# EAGLE design Bordnetzwandler (EAGLE 6.6.0)

## Sheet 1 of 4: Supply
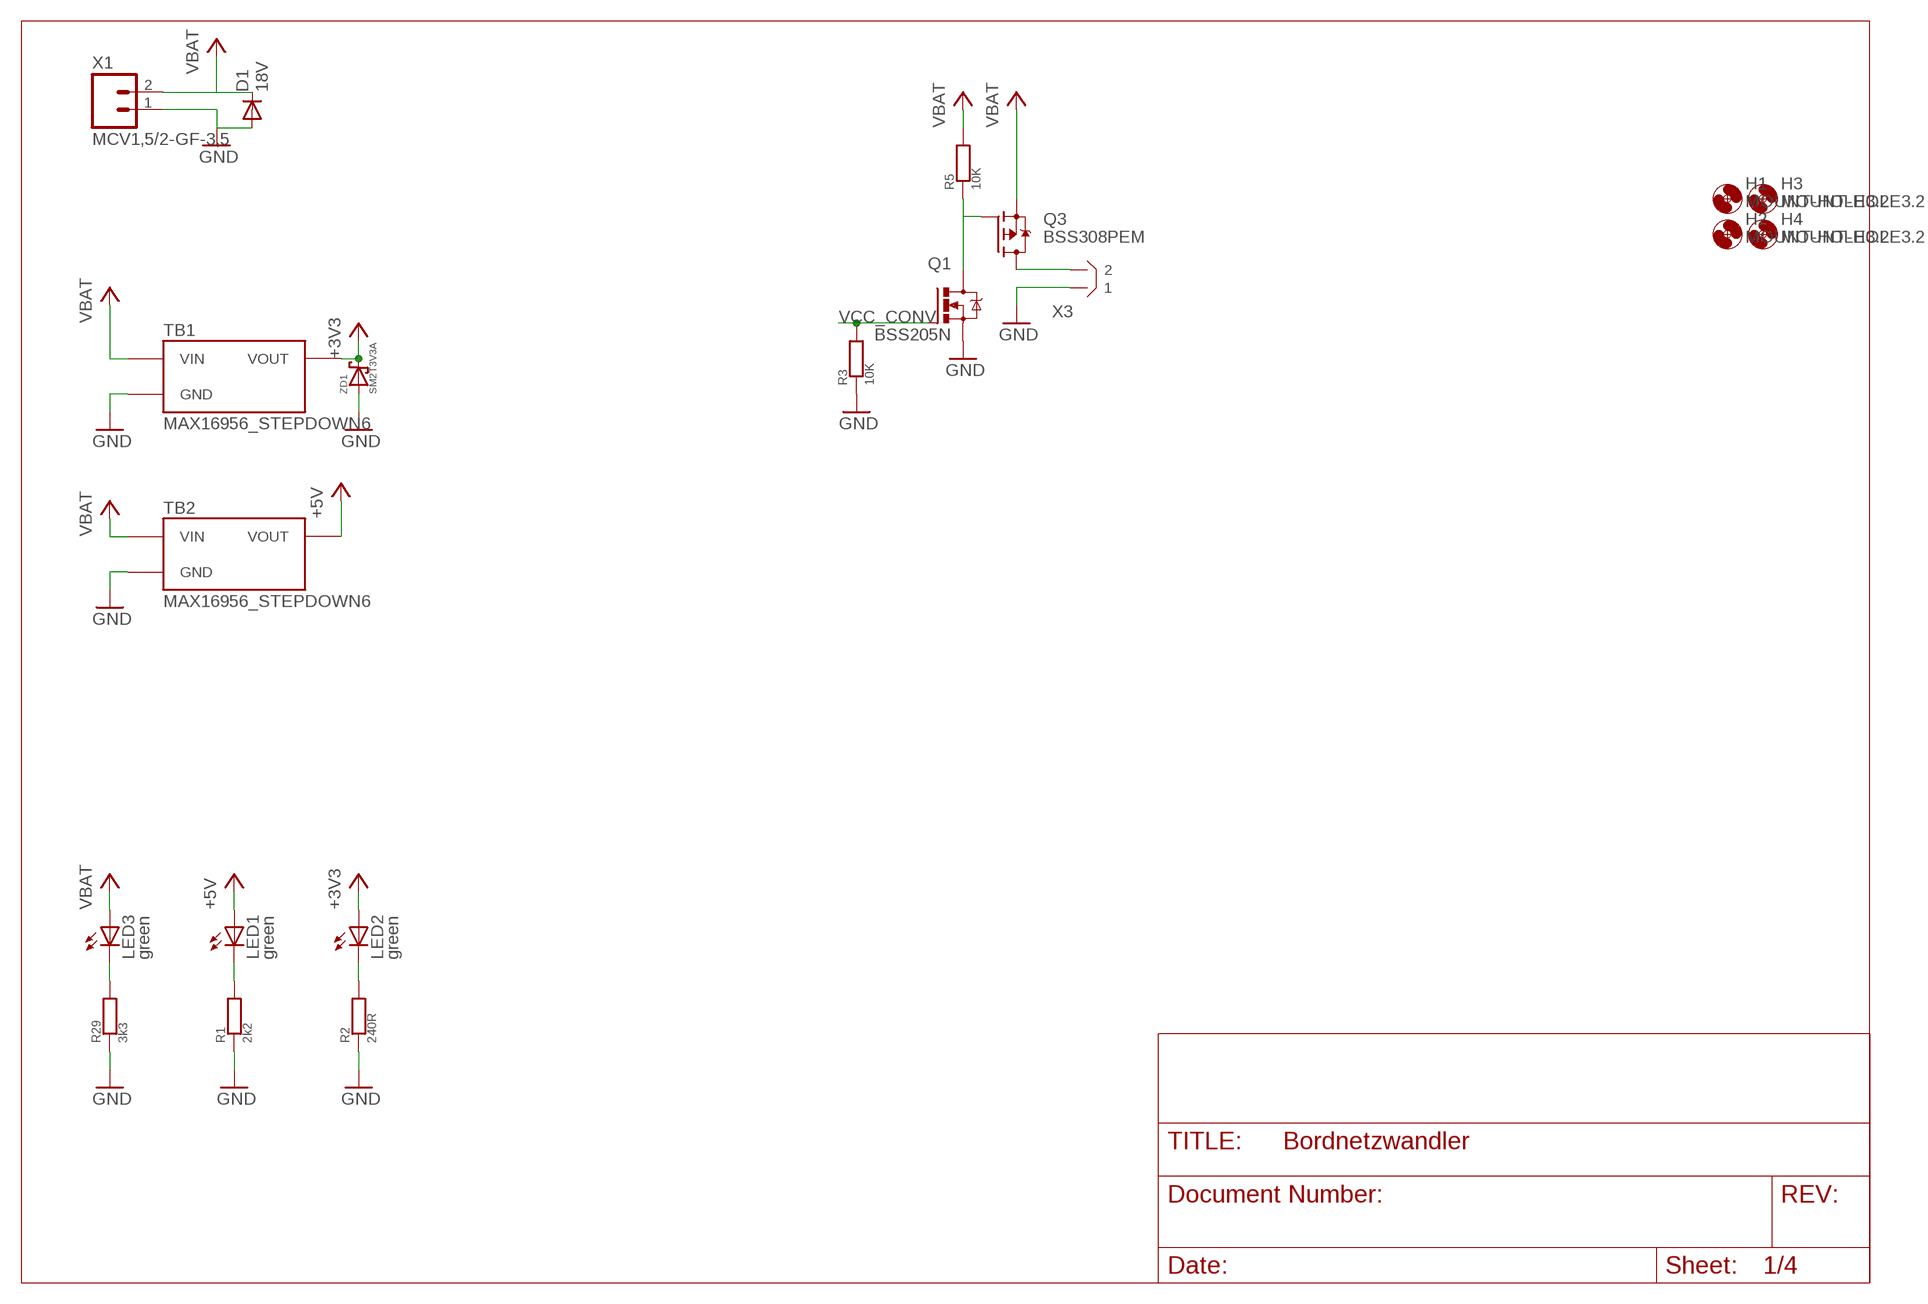
[diagram p0: schematic, sheet 1]

### Parts
D1  18V  DIODE-DO214AA  [DO214AA]
H1  MOUNT-HOLE3.2  [3,2]
H2  MOUNT-HOLE3.2  [3,2]
H3  MOUNT-HOLE3.2  [3,2]
H4  MOUNT-HOLE3.2  [3,2]
LED1  green  LEDCHIP-LED0805  [CHIP-LED0805]
LED2  green  LEDCHIP-LED0805  [CHIP-LED0805]
LED3  green  LEDCHIP-LED0805  [CHIP-LED0805]
Q1  BSS205N  [SOT23]
Q3  BSS308PEM  [INF-PG-SOT23_M_1PRIMARY]
R1  2k2  R  [R0805]
R2  240R  R  [R0805]
R3  10K  R  [R0805]
R5  10K  R  [R0805]
R29  3k3  R  [R0805]
TB1  MAX16956_STEPDOWN6  [MAX16956_STEPDOWN6]
TB2  MAX16956_STEPDOWN6  [MAX16956_STEPDOWN6]
X1  MCV1,5/2-GF-3,5  [MCV1,5/2-GF-3,5]
X3  B2B-XH  [B2B-XH]
ZD1  SM2T3V3A  [SM2T3V3A]

### Nets
+3V3: LED2.A TB1.VOUT ZD1.P$2 ; also sheet 2,4
+5V: LED1.A TB2.VOUT ; also sheet 2,3
GND: D1.A Q1.2(S) R1.1 R2.1 R3.1 R29.1 TB1.GND TB1.GND2(GND) TB2.GND TB2.GND2(GND) X1.1 X3.P$1 ZD1.P$1 ZD1.P$11 ; also sheet 2,3,4
N$1: LED1.C R1.2
N$2: LED2.C R2.2
N$3: Q1.3(D) Q3.1(G) R5.1
N$5: LED3.C R29.2
N$6: Q3.3(D) X3.P$2
VBAT: D1.C LED3.A Q3.2(S) R5.2 TB1.VIN TB2.VIN X1.2 ; also sheet 2,3,4
VCC_CONV: Q1.1(G) R3.2 ; also sheet 2

## Sheet 2 of 4: Prozessor
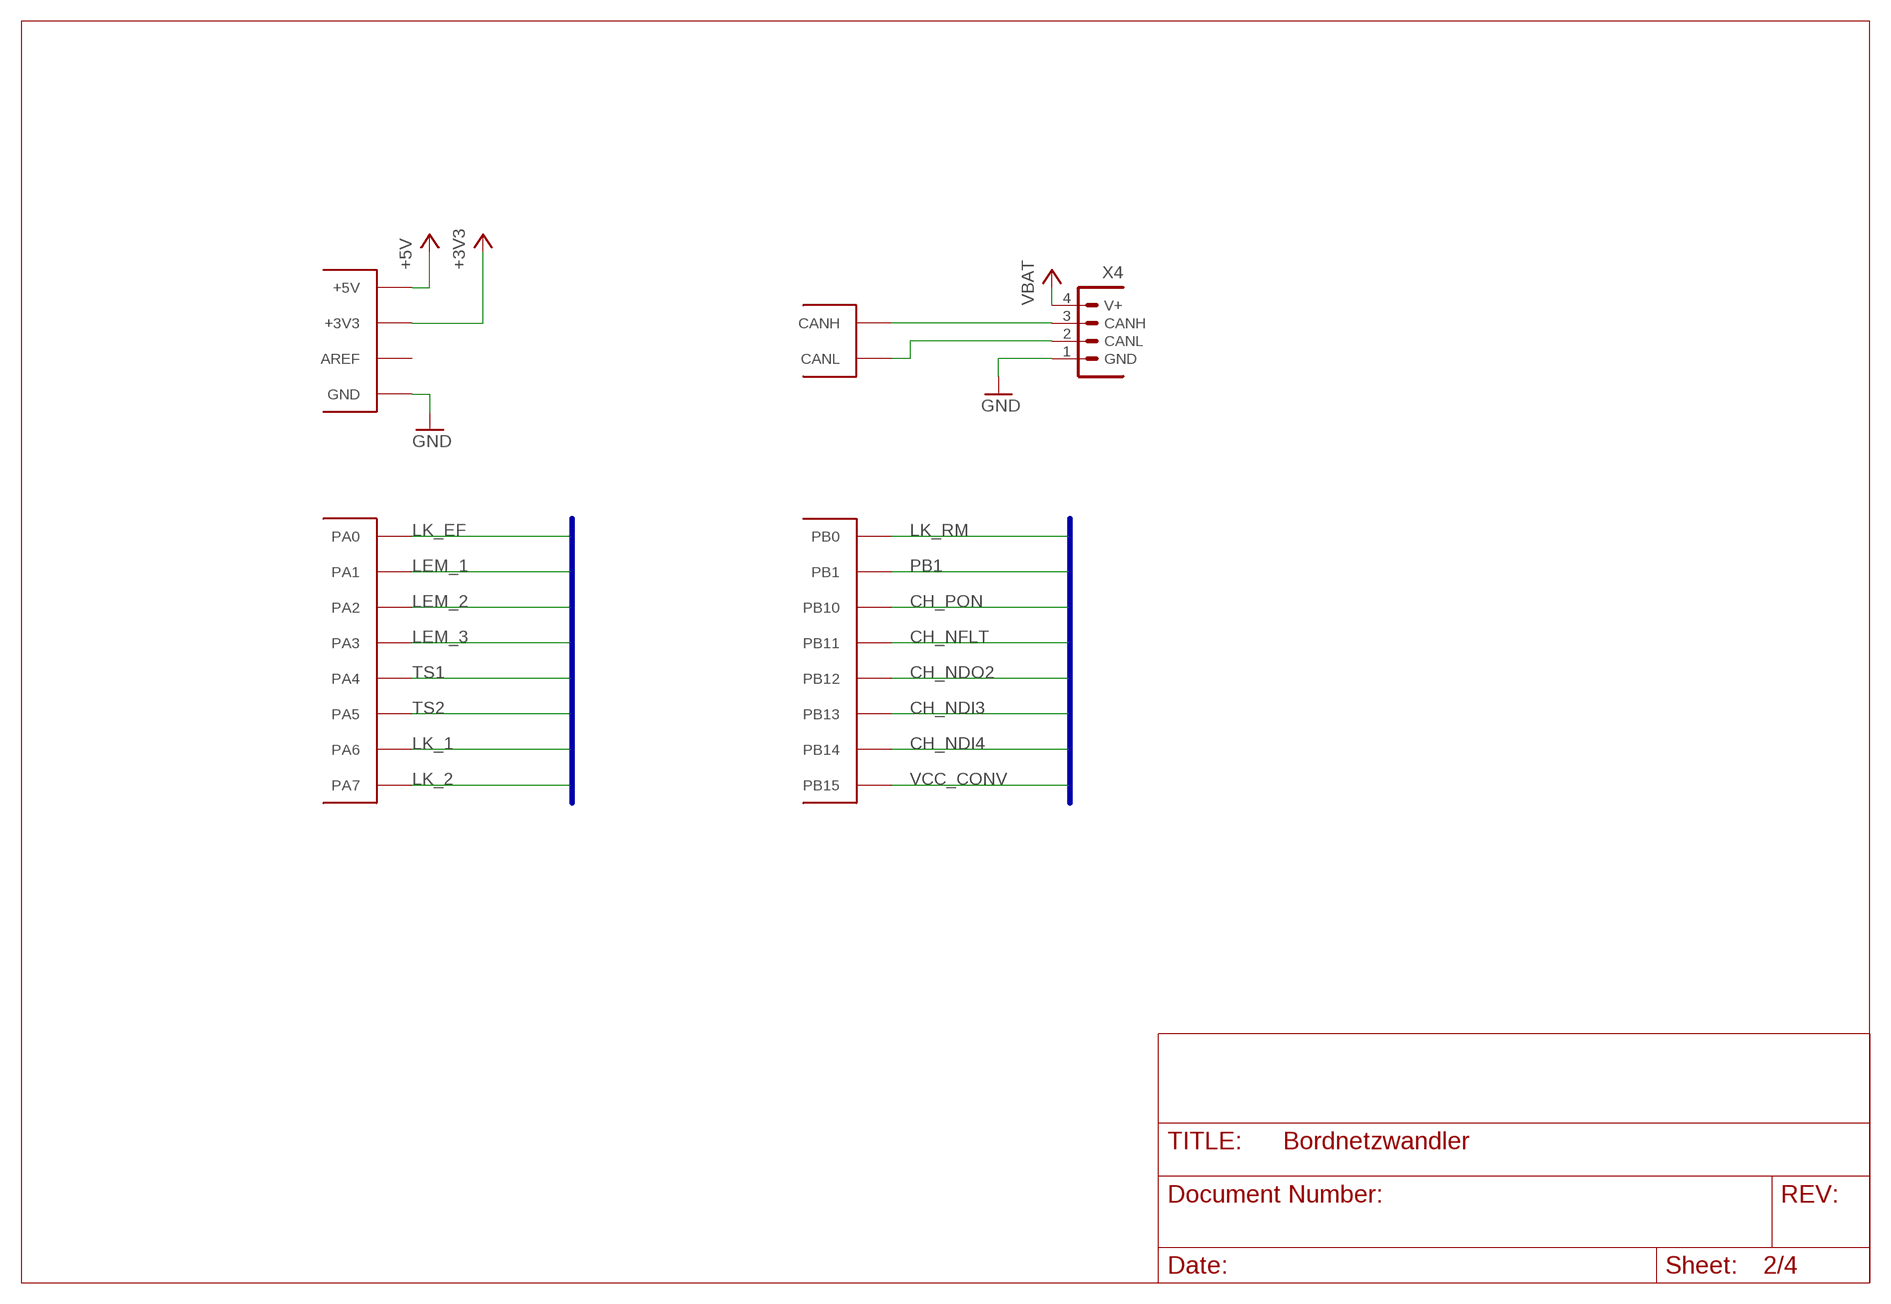
[diagram p1: schematic, sheet 2]

### Parts
CANIO_1  STM32F103XX_CAN-IO-EXPANDER  [STM32F103XX_CANIO-EXPANDER]
X4  CIOC_4-1-FV-A_CAN-BELEGUNG  [CIOC_4-1-FV]

### Nets
+3V3: CANIO_1.VCC(+3V3) ; also sheet 1,4
+5V: CANIO_1.+5V ; also sheet 1,3
CAN1_H: CANIO_1.CANH X4.3(CANH)
CAN1_L: CANIO_1.CANL X4.2(CANL)
CH_NDI3: CANIO_1.PB13 ; also sheet 4
CH_NDI4: CANIO_1.PB14 ; also sheet 4
CH_NDO2: CANIO_1.PB12 ; also sheet 4
CH_NFLT: CANIO_1.PB11 ; also sheet 4
CH_PON: CANIO_1.PB10 ; also sheet 4
GND: CANIO_1.GND1(GND) X4.1(GND) ; also sheet 1,3,4
LEM_1: CANIO_1.PA1 ; also sheet 3
LEM_2: CANIO_1.PA2 ; also sheet 3
LEM_3: CANIO_1.PA3 ; also sheet 3
LK_1: CANIO_1.PA6 ; also sheet 4
LK_2: CANIO_1.PA7 ; also sheet 4
LK_EF: CANIO_1.PA0 ; also sheet 4
LK_RM: CANIO_1.PB0 ; also sheet 4
PB1: CANIO_1.PB1
TS1: CANIO_1.PA4 ; also sheet 3
TS2: CANIO_1.PA5 ; also sheet 3
VBAT: X4.4(V+) ; also sheet 1,3,4
VCC_CONV: CANIO_1.PB15 ; also sheet 1
Unconnected: CANIO_1.AREF

### Buses
PA[0..7]
PB[10..15],PB[0..1]

## Sheet 3 of 4: IO
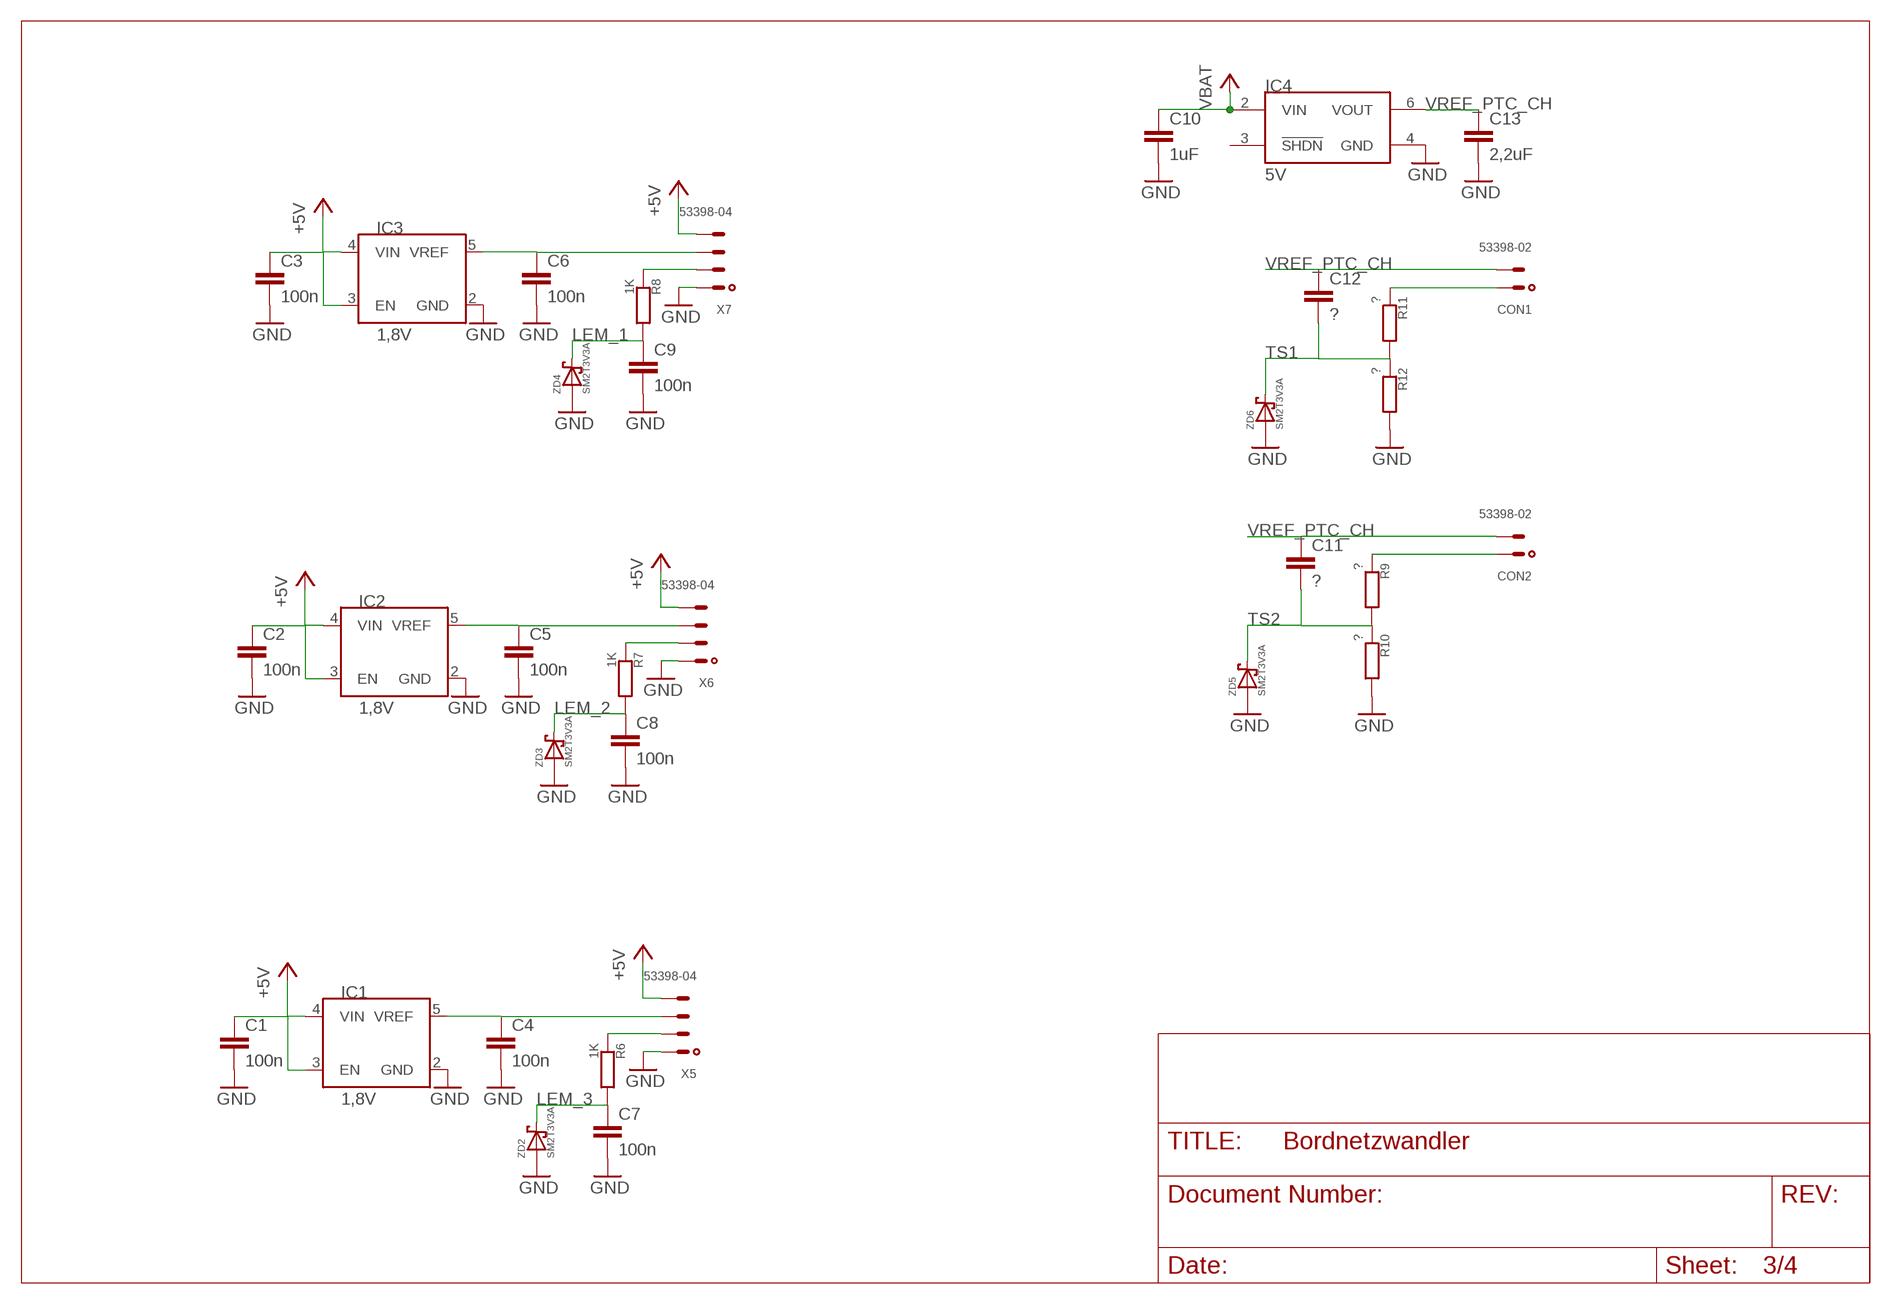
[diagram p2: schematic, sheet 3]

### Parts
C1  100n  C-EUC0805  [C0805]
C2  100n  C-EUC0805  [C0805]
C3  100n  C-EUC0805  [C0805]
C4  100n  C-EUC0805  [C0805]
C5  100n  C-EUC0805  [C0805]
C6  100n  C-EUC0805  [C0805]
C7  100n  C-EUC0805  [C0805]
C8  100n  C-EUC0805  [C0805]
C9  100n  C-EUC0805  [C0805]
C10  1uF  C-EUC0805  [C0805]
C11  ?  C-EUC0805  [C0805]
C12  ?  C-EUC0805  [C0805]
C13  2,2uF  C-EUC0805  [C0805]
CON1  53398-02  [53398-02]
CON2  53398-02  [53398-02]
IC1  1,8V  LM4132L  [SOT23-5L]
IC2  1,8V  LM4132L  [SOT23-5L]
IC3  1,8V  LM4132L  [SOT23-5L]
IC4  5V  LT1461  [SO08]
R6  1K  R  [R0805]
R7  1K  R  [R0805]
R8  1K  R  [R0805]
R9  ?  R  [R0805]
R10  ?  R  [R0805]
R11  ?  R  [R0805]
R12  ?  R  [R0805]
X5  53398-04  [53398-04]
X6  53398-04  [53398-04]
X7  53398-04  [53398-04]
ZD2  SM2T3V3A  [SM2T3V3A]
ZD3  SM2T3V3A  [SM2T3V3A]
ZD4  SM2T3V3A  [SM2T3V3A]
ZD5  SM2T3V3A  [SM2T3V3A]
ZD6  SM2T3V3A  [SM2T3V3A]

### Nets
+5V: C1.1 C2.1 C3.1 IC1.3(EN) IC1.4(VIN) IC2.3(EN) IC2.4(VIN) IC3.3(EN) IC3.4(VIN) X5.4 X6.4 X7.4 ; also sheet 1,2
GND: C1.2 C2.2 C3.2 C4.2 C5.2 C6.2 C7.2 C8.2 C9.2 C10.2 C13.2 IC1.2(GND) IC2.2(GND) IC3.2(GND) IC4.4(GND) R10.2 R12.2 X5.1 X6.1 X7.1 ZD2.P$1 ZD2.P$11 ZD3.P$1 ZD3.P$11 ZD4.P$1 ZD4.P$11 ZD5.P$1 ZD5.P$11 ZD6.P$1 ZD6.P$11 ; also sheet 1,2,4
LEM_1: C9.1 R8.2 ZD4.P$2 ; also sheet 2
LEM_2: C8.1 R7.2 ZD3.P$2 ; also sheet 2
LEM_3: C7.1 R6.2 ZD2.P$2 ; also sheet 2
N$4: C4.1 IC1.5(VREF) X5.3
N$7: R8.1 X7.2
N$9: C5.1 IC2.5(VREF) X6.3
N$25: CON1.1 R11.1
N$31: R7.1 X6.2
N$32: C6.1 IC3.5(VREF) X7.3
N$33: R6.1 X5.2
N$35: CON2.1 R9.1
TS1: C12.2 R11.2 R12.1 ZD6.P$2 ; also sheet 2
TS2: C11.2 R9.2 R10.1 ZD5.P$2 ; also sheet 2
VBAT: C10.1 IC4.2(VIN) ; also sheet 1,2,4
VREF_PTC_CH: C11.1 C12.1 C13.1 CON1.2 CON2.2 IC4.6(VOUT)
Unconnected: IC4.3(!SHDN)

## Sheet 4 of 4: Laderegler und Ladestecker
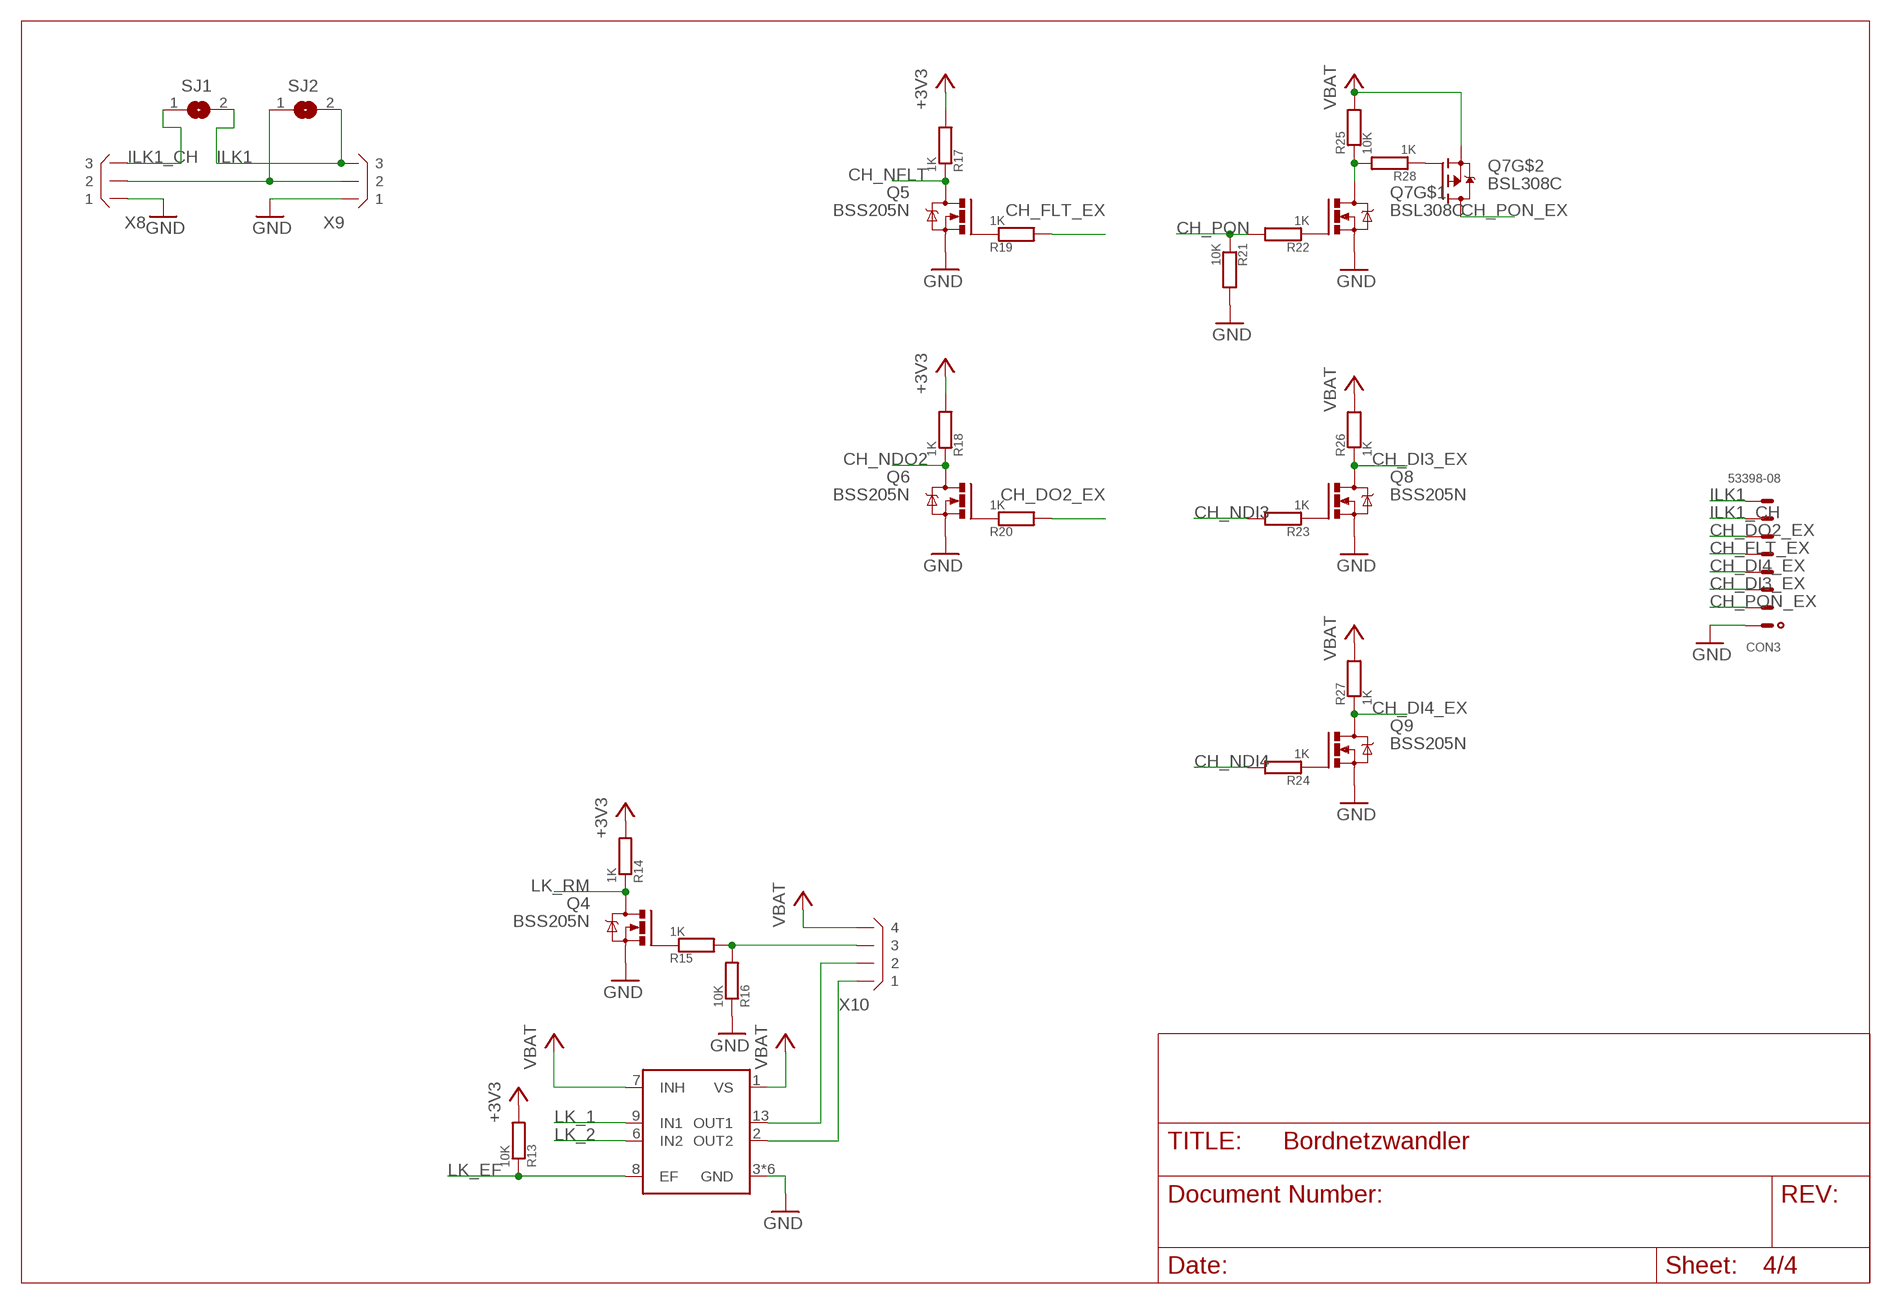
[diagram p3: schematic, sheet 4]

### Parts
CON3  53398-08  [53398-08]
IC5  TLE4207GN  [INF-PG-DSO-14-22_N_1PRIMARY]
Q4  BSS205N  [SOT23]
Q5  BSS205N  [SOT23]
Q6  BSS205N  [SOT23]
Q7  BSL308C  [TSOP-6]
Q8  BSS205N  [SOT23]
Q9  BSS205N  [SOT23]
R13  10K  R  [R0805]
R14  1K  R  [R0805]
R15  1K  R  [R0805]
R16  10K  R  [R0805]
R17  1K  R0603  [R0603]
R18  1K  R0603  [R0603]
R19  1K  R0603  [R0603]
R20  1K  R0603  [R0603]
R21  10K  R0603  [R0603]
R22  1K  R0603  [R0603]
R23  1K  R0603  [R0603]
R24  1K  R0603  [R0603]
R25  10K  R0603  [R0603]
R26  1K  R0603  [R0603]
R27  1K  R0603  [R0603]
R28  1K  R0603  [R0603]
SJ1  SJ  [SJ]
SJ2  SJ  [SJ]
X8  B3B-XH  [B3B-XH]
X9  B3B-XH  [B3B-XH]
X10  B4B-XH  [B4B-XH]

### Nets
+3V3: R13.2 R14.2 R17.2 R18.2 ; also sheet 1,2
CH_DI3_EX: CON3.3 Q8.3(D) R26.1
CH_DI4_EX: CON3.4 Q9.3(D) R27.1
CH_DO2_EX: CON3.6 R20.2
CH_FLT_EX: CON3.5 R19.2
CH_NDI3: R23.2 ; also sheet 2
CH_NDI4: R24.2 ; also sheet 2
CH_NDO2: Q6.3(D) R18.1 ; also sheet 2
CH_NFLT: Q5.3(D) R17.1 ; also sheet 2
CH_PON: R21.1 R22.2 ; also sheet 2
CH_PON_EX: CON3.2 Q7.P$4(D)
GND: CON3.1 IC5.3(GND) IC5.4(GND) IC5.5(GND) IC5.10(GND) IC5.11(GND) IC5.12(GND) Q4.2(S) Q5.2(S) Q6.2(S) Q7.P$5(S) Q8.2(S) Q9.2(S) R16.1 R21.2 X8.P$1 X9.P$1 ; also sheet 1,2,3
ILK1: CON3.8 SJ1.2 SJ2.2 X9.P$3
ILK1_CH: CON3.7 SJ1.1 X8.P$3
ILK2: SJ2.1 X8.P$2 X9.P$2
LK_1: IC5.9(IN1) ; also sheet 2
LK_2: IC5.6(IN2) ; also sheet 2
LK_EF: IC5.8(EF) R13.1 ; also sheet 2
LK_RM: Q4.3(D) R14.1 ; also sheet 2
N$16: Q6.1(G) R20.1
N$34: Q8.1(G) R23.1
N$38: Q4.1(G) R15.1
N$39: R15.2 R16.2 X10.P$3
N$40: Q7.P$3(G) R28.1
N$41: IC5.13(OUT1) X10.P$2
N$42: IC5.2(OUT2) X10.P$1
N$43: Q7.P$1(G) R22.1
N$44: Q9.1(G) R24.1
N$45: Q5.1(G) R19.1
N$50: Q7.P$6(D) R25.1 R28.2
VBAT: IC5.1(VS) IC5.7(INH) Q7.P$2(S) R25.2 R26.2 R27.2 X10.P$4 ; also sheet 1,2,3

## Library data of the parts
C1-C13 = rcl:C-EU: CAPACITOR, European symbol
CANIO_1 = tera-boards:STM32F103XX_CAN-IO-EXPANDER: Tera CAN-IO Expander Board
CON1 CON2 = con-molex:53?-02: CONNECTOR wire to board 1.25 mm (.049 inch) pitch header
CON3 = con-molex:53?-08: CONNECTOR wire to board 1.25 mm (.049 inch) pitch header
D1 = diode:DIODE-: DIODE
H1-H4 = holes:MOUNT-HOLE: MOUNTING HOLE with drill center marker
IC1-IC3 = ti:LM4132
IC4 = linear:LT1461
IC5 = infineon:TLE4207G
LED1-LED3 = led:LED: LED OSRAM: - CHIPLED LG R971, LG N971, LY N971, LG Q971, LY Q971, LO R971, LY R971 LH N974, LH R974 LS Q976, LO Q976, LY Q976 LO Q996 - Hyper CHIPLED LW Q18S LB Q993, LB Q99A, LB R99A - SideLED LS A670, LO A670, LY A670, LG A670, LP A670 LB A673, LV A673, LT A673, LW A673 LH A674 LY A675 LS A676, LA A676, LO A676, LY A676, LW A676 LS A679, LY A679, LG A679 - Hyper Micro SIDELED® LS Y876, LA Y876, LO Y876, LY Y876 LT Y87S - SmartLED LW L88C, LW L88S LB L89C, LB L89S, LG L890 LS L89K, LO L89K, LY L89K LS L896, LA L896, LO L896, LY L896 - TOPLED LS T670, LO T670, LY T670, LG T670, LP T670 LSG T670, LSP T670, LSY T670, LOP T670, LYG T670 LG T671, LOG T671, LSG T671 LB T673, LV T673, LT T673, LW T673 LH T674 LS T676, LA T676, LO T676, LY T676, LB T676, LH T676, LSB T676, LW T676 LB T67C, LV T67C, LT T67C, LS T67K, LO T67K, LY T67K, LW E67C LS E67B, LA E67B, LO E67B, LY E67B, LB E67C, LV E67C, LT E67C LW T67C LS T679, LY T679, LG T679 LS T770, LO T770, LY T770, LG T770, LP T770 LB T773, LV T773, LT T773, LW T773 LH T774 LS E675, LA E675, LY E675, LS T675 LS T776, LA T776, LO T776, LY T776, LB T776 LHGB T686 LT T68C, LB T68C - Hyper Mini TOPLED® LB M676 - Mini TOPLED Santana® LG M470 LS M47K, LO M47K, LY M47K Source: http://www.osram.convergy.de LUXEON: - LUMILED® LXK2-PW12-R00, LXK2-PW12-S00, LXK2-PW14-U00, LXK2-PW14-V00 LXK2-PM12-R00, LXK2-PM12-S00, LXK2-PM14-U00 LXK2-PE12-Q00, LXK2-PE12-R00, LXK2-PE12-S00, LXK2-PE14-T00, LXK2-PE14-U00 LXK2-PB12-K00, LXK2-PB12-L00, LXK2-PB12-M00, LXK2-PB14-N00, LXK2-PB14-P00, LXK2-PB14-Q00 LXK2-PR12-L00, LXK2-PR12-M00, LXK2-PR14-Q00, LXK2-PR14-R00 LXK2-PD12-Q00, LXK2-PD12-R00, LXK2-PD12-S00 LXK2-PH12-R00, LXK2-PH12-S00 LXK2-PL12-P00, LXK2-PL12-Q00, LXK2-PL12-R00 Source: www.luxeon.com KINGBRIGHT: KA-3528ASYC Source: www.kingbright.com
Q1 Q4-Q6 Q8 Q9 = infineon:BSS205N: Infineon Small Signal Transistor, OptiMOS 2 Technology, 20V, 2.5A SOT23
Q3 = infineon:BSS308PE
Q7 = infineon:BSL308C: BSL308C Complementary power MOSFETs - an n-channel and a p-channel power MOSFET within the same package - are part of Infineon’s famous low voltage OptiMOS™ families URL: http://www.infineon.com/cms/de/product/power/mosfet/power-mosfet/complementary-20v-60v/BSL308C/productType.html?productType=db3a304442b7c1190142d715b4ac330e
R1-R3 R5-R29 = useful:R
SJ1 SJ2 = jumper:SJ: SMD solder JUMPER
TB1 TB2 = tera-boards:MAX16956_STEPDOWN6
X1 = con-phoenix:MCV1,5/2-GF-3,5
X3 = con-jst-xh:?2B-XH
X4 = con-phoenix:CIOC_4-1-FV-A_CAN-BELEGUNG: CIOC_4-1-FV-A mit Bezeichnungen für CAN-Signale und Versorgungen; MANUF: Phoenix-Contact; ORDERNR: 1701388
X5-X7 = con-molex:53?-04: CONNECTOR wire to board 1.25 mm (.049 inch) pitch header
X8 X9 = con-jst-xh:?3B-XH
X10 = con-jst-xh:?4B-XH
ZD1-ZD6 = st:SM2T3V3A: ST2T3V3A Low voltage TransilTM

## Board
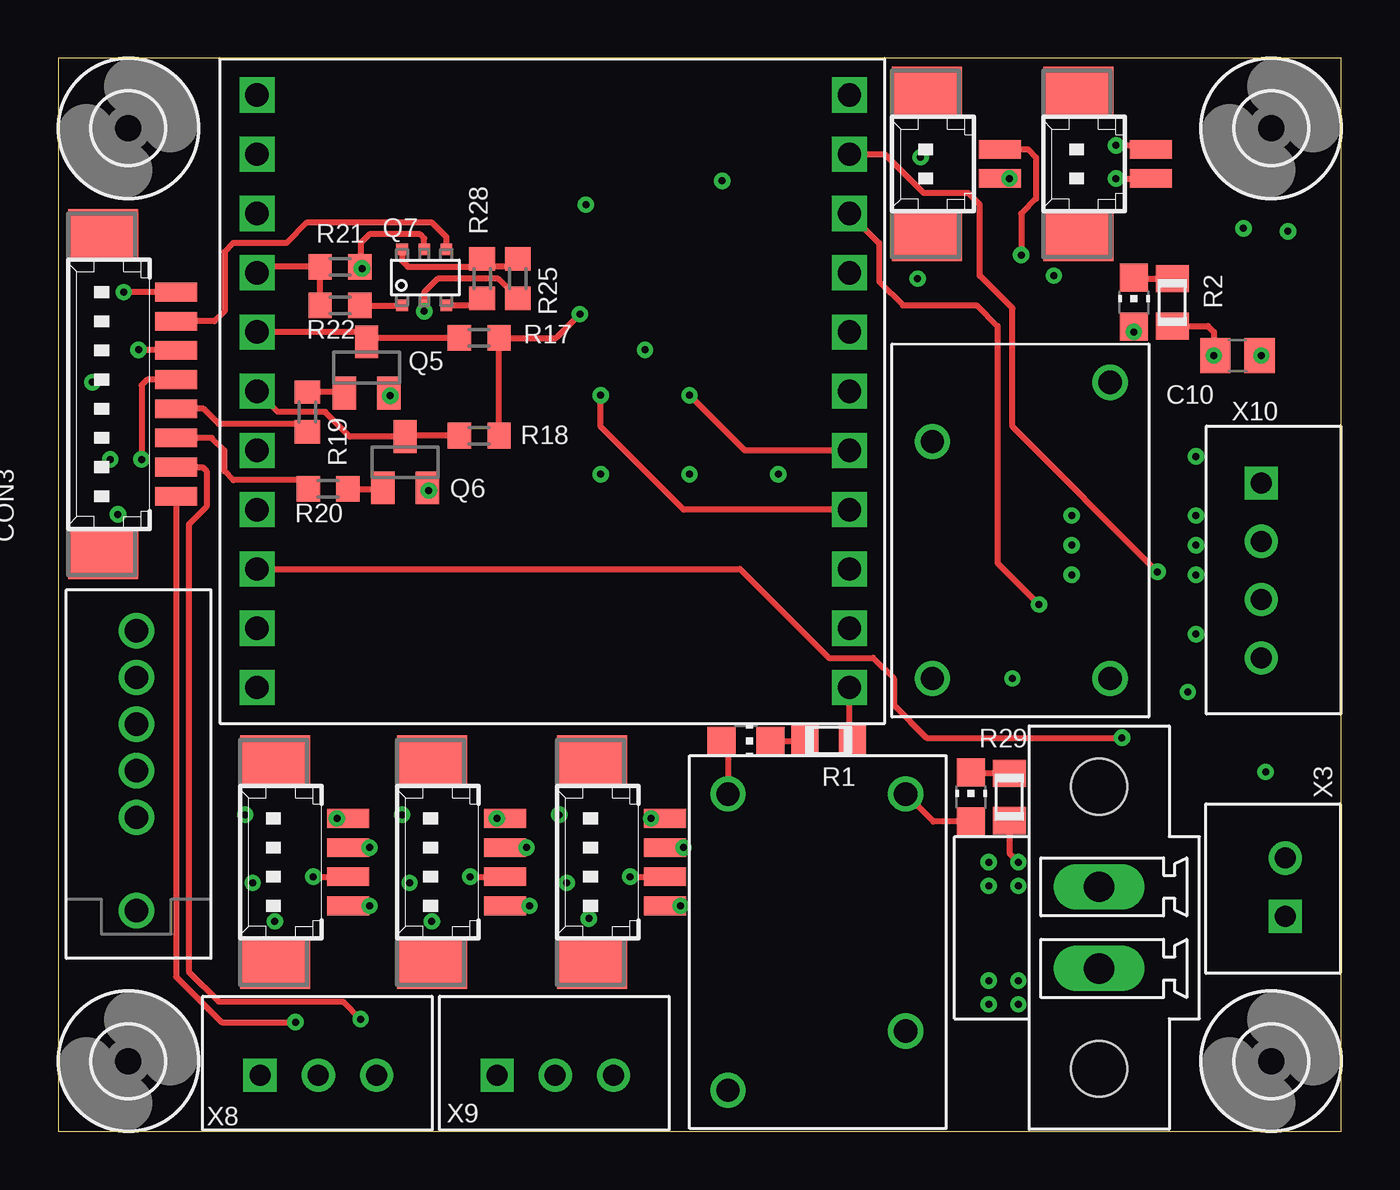
[diagram p4: board, top side]
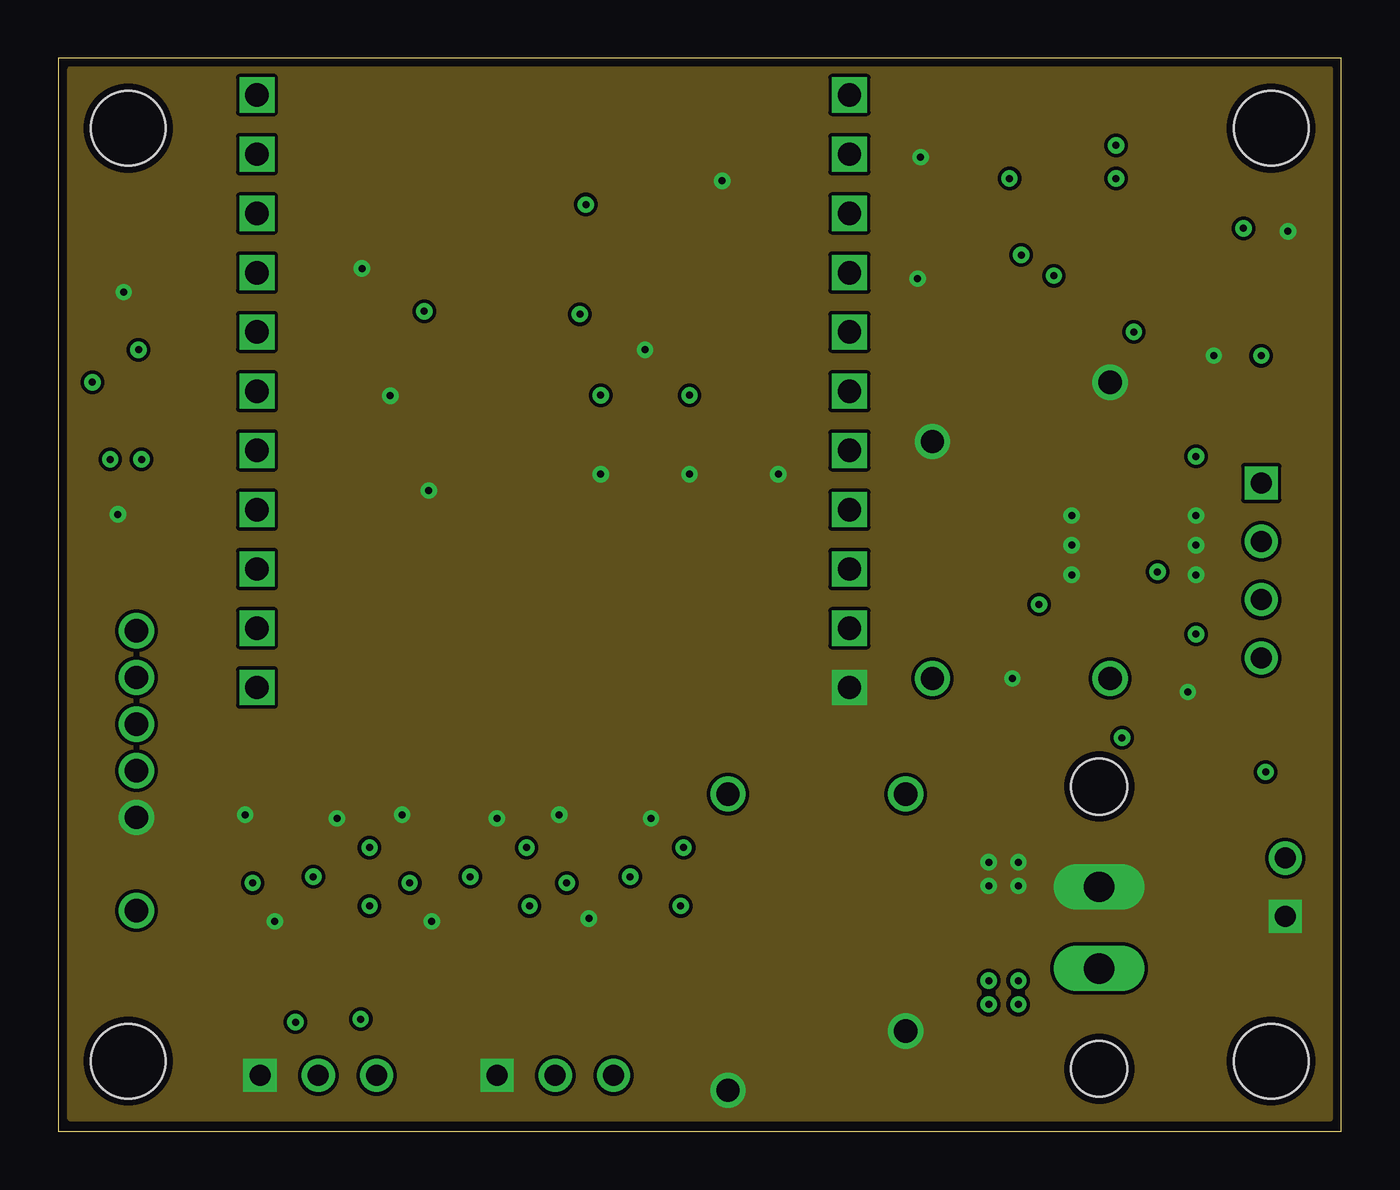
[diagram p5: board, inner layer Route2]
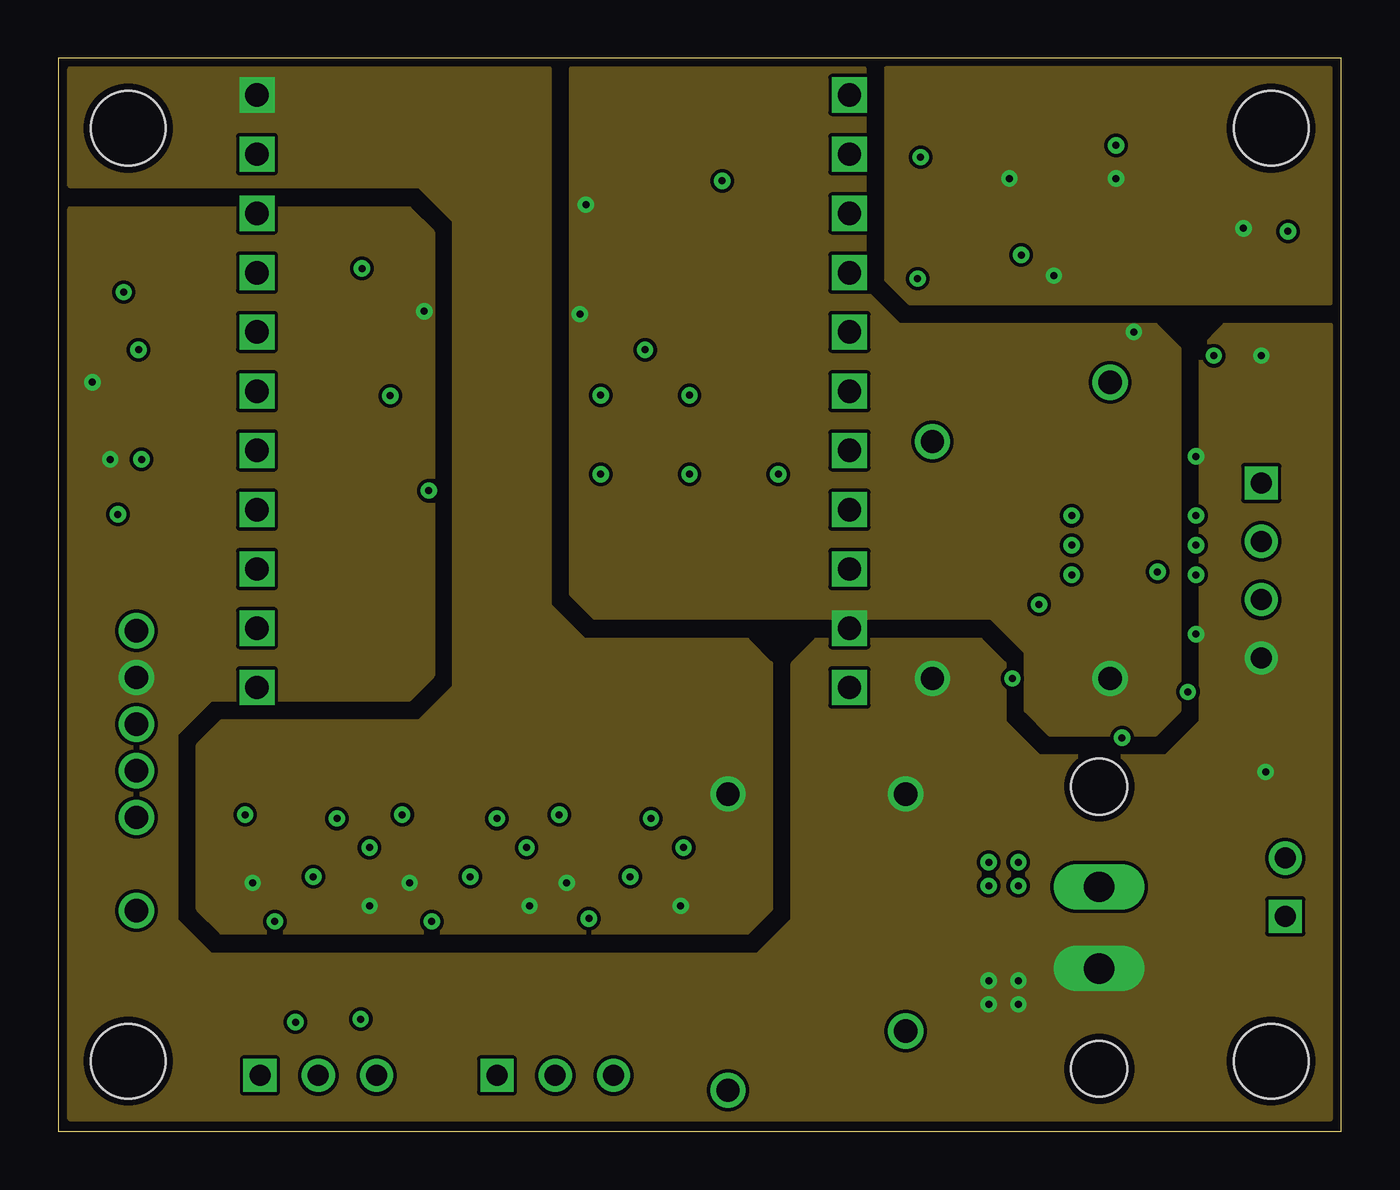
[diagram p6: board, inner layer Route15]
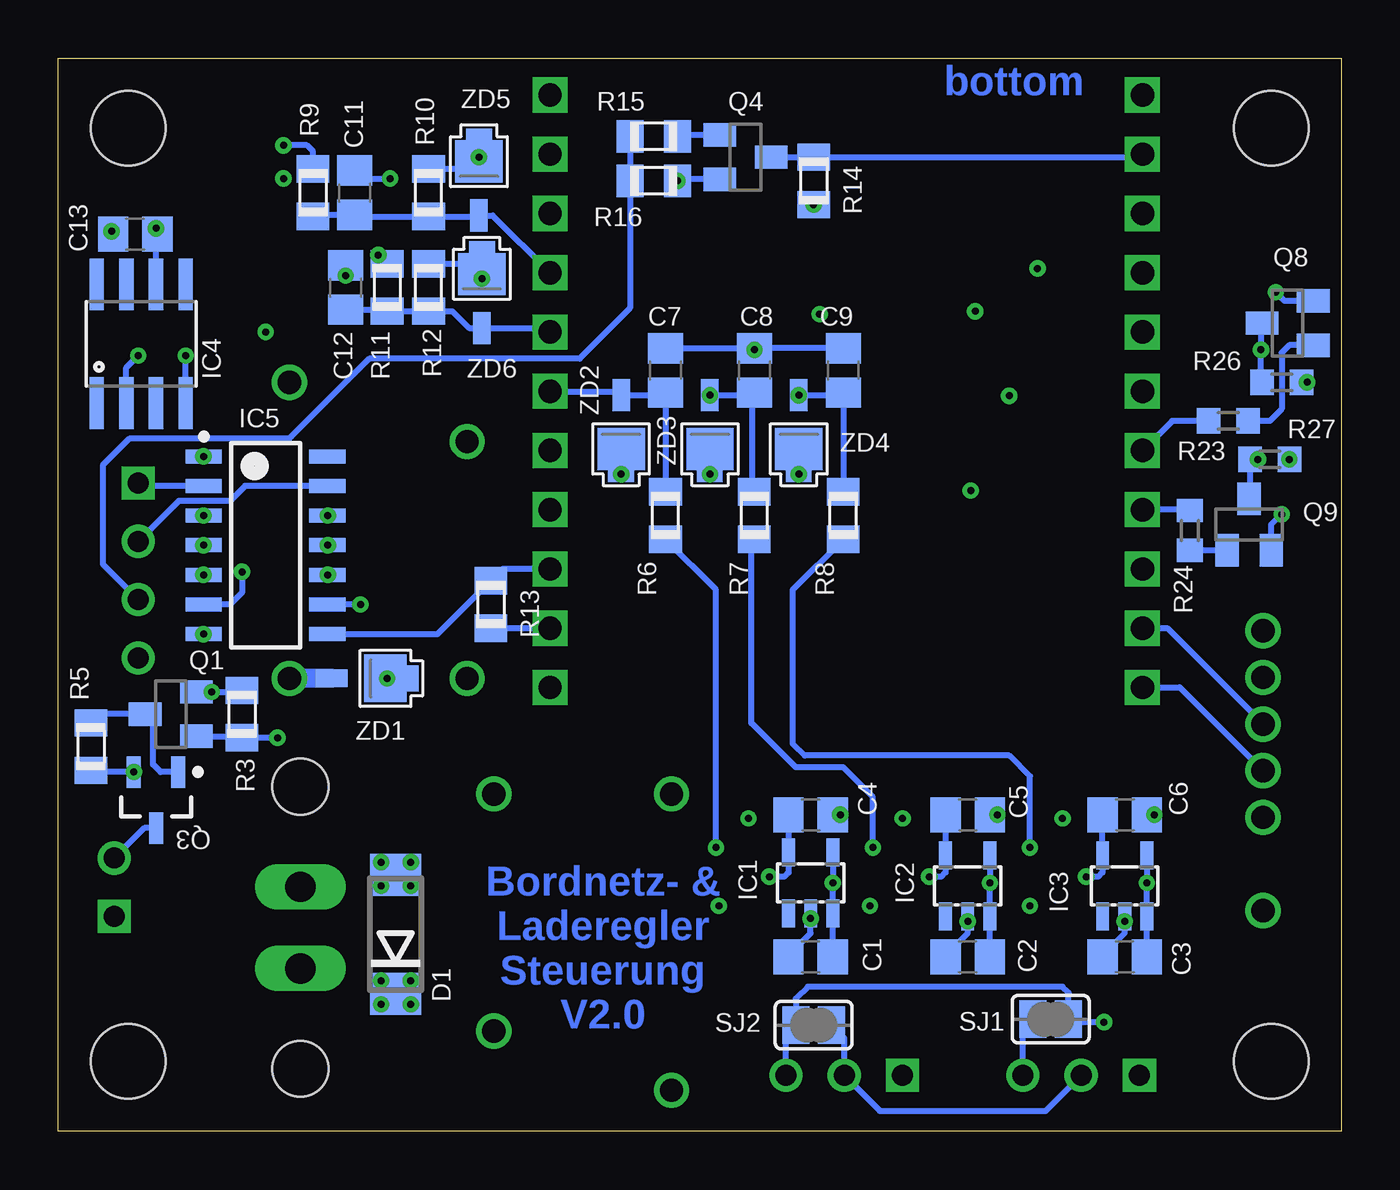
[diagram p7: board, bottom side, seen from below]

Size 55 x 46 mm. Coordinates in mm from the lower left corner, seen from the top.
Outline: 0,0 55,0 55,46 0,46 0,0
Copper layers (1+2*15+16): Top 0.035mm / dielectric 0.2mm / Route2 0.035mm / dielectric 0.5mm / Route15 0.035mm / dielectric 0.2mm / Bottom 0.035mm
Design rules "ats_35u_4layer *": minimum track width 6mil, minimum drill 0.2mm, track to track 6mil, track to pad 6mil, pad to pad 6mil, via to via 6mil, smd to smd 6mil, copper to edge 0.3mm, drill to drill 8mil, minimum pad ring 10mil, minimum via ring 0.2mm, stop-mask expansion 4mil, vias tented up to drill 0mil, thermal gap 10mil

### Footprints (pad centres in the part's own frame; a part is rotated, then mirrored left to right if it is on the bottom)
C0805 = smd 1.3 x 1.5: 1 -0.95,0; 2 0.95,0
STM32F103XX_CANIO-EXPANDER = drill 1 square: +5V 0,0; AREF 25.4,0; CANH 0,-22.86; CANL 0,-25.4; GND1 25.4,-25.4; PA0 25.4,-20.32; PA1 25.4,-17.78; PA2 25.4,-15.24; PA3 25.4,-12.7; PA4 25.4,-10.16; PA5 25.4,-7.62; PA6 25.4,-5.08; PA7 25.4,-2.54; PB0 0,-2.54; PB1 0,-5.08; PB10 0,-7.62; PB11 0,-10.16; PB12 0,-12.7; PB13 0,-15.24; PB14 0,-17.78; PB15 0,-20.32; VCC 25.4,-22.86
53398-02 = smd 0.8 x 1.8: 1 0.625,-2.5; 2 -0.625,-2.5 | smd 2.1 x 3: S1 3.125,0.625; S2 -3.125,0.625
53398-08 = smd 0.8 x 1.8: 1 4.375,-2.5; 2 3.125,-2.5; 3 1.875,-2.5; 4 0.625,-2.5; 5 -0.625,-2.5; 6 -1.875,-2.5; 7 -3.125,-2.5; 8 -4.375,-2.5 | smd 2.1 x 3: S1 6.875,0.625; S2 -6.875,0.625
DO214AA = smd 1.8 x 2.2: A 2.55,0; C -2.55,0
3,2 = hole 3.2: 0,0
SOT23-5L = smd 0.55 x 1.2: 1 -0.95,-1.3; 2 0,-1.3; 3 0.95,-1.3; 4 0.95,1.3; 5 -0.95,1.3
SO08 = smd 0.61 x 2.21: 1 -1.905,-2.54; 2 -0.635,-2.54; 3 0.635,-2.54; 4 1.905,-2.54; 5 1.905,2.54; 6 0.635,2.54; 7 -0.635,2.54; 8 -1.905,2.54
INF-PG-DSO-14-22_N_1PRIMARY = smd 1.55 x 0.6: 1 -2.65,3.81; 2 -2.65,2.54; 3 -2.65,1.27; 4 -2.65,0; 5 -2.65,-1.27; 6 -2.65,-2.54; 7 -2.65,-3.81; 8 2.65,-3.81; 9 2.65,-2.54; 10 2.65,-1.27; 11 2.65,0; 12 2.65,1.27; 13 2.65,2.54; 14 2.65,3.81
CHIP-LED0805 = smd 1.2 x 1.2: A 0,-1.05; C 0,1.05
SOT23 = smd 1 x 1.4: 1 -0.95,-1.1; 2 0.95,-1.1; 3 0,1.1
INF-PG-SOT23_M_1PRIMARY = smd 1.35 x 0.6: 1 -1.2,0.95; 2 -1.2,-0.95; 3 1.2,0
TSOP-6 = smd 0.5 x 0.5: P$1 0.25,-0.25; P$2 0.25,-1.2; P$3 0.25,-2.15; P$4 2.65,-2.15; P$5 2.65,-1.2; P$6 2.65,-0.25
R0805 = smd 1.168 x 1.397: 1 -1.016,0; 2 1.016,0
R0603 = smd 1 x 1.1: 1 -0.85,0; 2 0.85,0
SJ = smd 1.168 x 1.6: 1 -0.762,0; 2 0.762,0
MAX16956_STEPDOWN6 = drill 1: GND 14.351,1.651; GND2 11.811,9.271; VIN 1.651,9.271; VOUT 1.651,1.651
MCV1,5/2-GF-3,5 = drill 1.3 long: 1 0,3.5; 2 0,0 | hole 2.4: 0,7.8; 0,-4.3
B2B-XH = drill 0.9 pad 1.422 square: P$1 0,0 | drill 0.9 pad 1.422: P$2 2.5,0
CIOC_4-1-FV = drill 1: 1 0,0; 2 2,0; 3 4,0; 4 6,0; 5 -4,0; 6 8,0
53398-04 = smd 0.8 x 1.8: 1 1.875,-2.5; 2 0.625,-2.5; 3 -0.625,-2.5; 4 -1.875,-2.5 | smd 2.1 x 3: S1 4.375,0.625; S2 -4.375,0.625
B3B-XH = drill 0.9 pad 1.422 square: P$1 0,0 | drill 0.9 pad 1.422: P$2 2.5,0; P$3 5,0
B4B-XH = drill 0.9 pad 1.422 square: P$1 0,0 | drill 0.9 pad 1.422: P$2 2.5,0; P$3 5,0; P$4 7.5,0
SM2T3V3A = smd 1.82 x 2.03: P$1 -1.21,0 | smd 1.38 x 0.75: P$2 1.1,0 | smd 0.5 x 1.1: P$11 -2.37,0.005

### Placement (x,y rotation side)
C1  22.74,7.47 180 bottom
C2  16.01,7.47 180 bottom
C3  9.28,7.47 180 bottom
C4  22.74,13.57 0 bottom
C5  16.01,13.57 0 bottom
C6  9.28,13.57 0 bottom
C7  28.97,32.62 90 bottom
C8  25.16,32.62 90 bottom
C9  21.35,32.62 90 bottom
C10  50.56,33.25 180 top
C11  42.3,40.24 270 bottom
C12  42.68,36.17 270 bottom
C13  51.7,38.46 180 bottom
CANIO_1  8.52,44.43 0 top
CON1  37.87,41.47 90 top
CON2  44.35,41.47 90 top
CON3  2.55,31.6 90 top
D1  40.54,8.45 90 bottom
H1  3,3 0 top
H2  52,3 0 top
H3  3,43 0 top
H4  52,43 0 top
IC1  22.74,10.64 0 bottom
IC2  16.01,10.52 0 bottom
IC3  9.28,10.52 0 bottom
IC4  51.45,33.76 0 bottom
IC5  46.11,25.12 0 bottom
LED1  29.47,16.74 270 top
LED2  46.11,35.54 0 top
LED3  39.13,14.33 0 top
Q1  50.17,17.88 90 bottom
Q3  50.81,14.2 270 bottom
Q4  25.54,41.76 270 bottom
Q5  13.22,32.74 0 top
Q6  14.87,28.68 0 top
Q7  14.49,35.16 90 top
Q8  2.3,34.65 90 bottom
Q9  3.95,26.01 0 bottom
R1  33.03,16.74 180 top
R2  47.76,35.54 90 top
R3  47.13,17.88 270 bottom
R5  53.6,16.49 270 bottom
R6  28.97,26.39 90 bottom
R7  25.16,26.39 90 bottom
R8  21.35,26.39 90 bottom
R9  44.08,40.24 270 bottom
R10  39.13,40.24 90 bottom
R11  40.9,36.17 270 bottom
R12  39.13,36.17 90 bottom
R13  36.46,22.58 270 bottom
R14  22.62,40.74 270 bottom
R15  29.47,42.65 180 bottom
R16  29.47,40.74 180 bottom
R17  18.04,34.01 0 top
R18  18.04,29.82 0 top
R19  10.68,30.84 270 top
R20  11.57,27.54 180 top
R21  12.08,37.06 0 top
R22  12.08,35.41 180 top
R23  4.84,30.46 180 bottom
R24  6.49,25.76 90 bottom
R25  19.7,36.55 270 top
R26  2.55,32.11 0 bottom
R27  3.06,28.81 0 bottom
R28  18.17,36.55 90 top
R29  40.78,14.33 90 top
SJ1  12.46,4.8 0 bottom
SJ2  22.62,4.55 180 bottom
TB1  46.75,17.76 90 top
TB2  27.06,16.11 270 top
X1  44.62,6.98 0 top
X3  52.6,9.21 90 top
X4  3.35,13.45 90 top
X5  23.5,11.53 90 top
X6  16.65,11.53 90 top
X7  9.92,11.53 90 top
X8  8.65,2.39 0 top
X9  18.81,2.39 0 top
X10  51.57,27.79 270 top
ZD1  42.18,19.41 180 bottom
ZD2  30.87,30.46 90 bottom
ZD3  27.06,30.46 90 bottom
ZD4  23.25,30.46 90 bottom
ZD5  36.97,40.36 270 bottom
ZD6  36.84,35.54 270 bottom

### Tracks (layer width: path | path; a pad name or v marks a point on that pad's centre or on a via)
+3V3  (via drill 0.3)
  Top 0.254: LED2.A v46.11,34.27 | v22.36,35.03 21.35,34.01 R17.2 R18.2
  Bottom 0.254: R13.2 CANIO_1.VCC
  Bottom 0.813: ZD1.P$2 TB1.VOUT
  other vias: 22.62,39.73
  pour Route15 (no thermals): 34.52,45.54 34.52,36.04 36.02,34.54 47.02,34.54 48.02,33.54 48.02,18.04 47.02,17.04 42.52,17.04 41.52,18.04 41.52,20.54 40.02,22.04 23.02,22.04 22.02,23.04 22.02,45.54
+5V  (via drill 0.3)
  Top 0.254: X6.4 v20.2,9.66 | X7.4 v13.35,9.66 | X5.4 v26.68,9.66 | LED1.A 28.71,16.74 TB2.VOUT
  Bottom 0.254: C3.1 IC3.3 v8.33,10.64 IC3.4 | C2.1 IC2.3 v15.06,10.64 IC2.4 | C1.1 IC1.3 v21.79,10.64 IC1.4
  pour Route15 (no thermals): 30.52,20.04 30.52,9.54 29.52,8.54 7.02,8.54 6.02,9.54 6.02,16.54 7.02,17.54 15.52,17.54 17.02,19.04 17.02,39.04 15.52,40.54 0.52,40.54 0.52,45.54 21.02,45.54 21.02,22.54 22.52,21.04 29.52,21.04
CAN1_H
  Bottom 0.254: CANIO_1.CANH 7.46,21.57 X4.3
CAN1_L
  Bottom 0.254: CANIO_1.CANL 6.92,19.03 X4.2
CH_DI3_EX  (via drill 0.3)
  Top 0.254: v3.44,33.5 5.05,33.5 CON3.3
  Bottom 0.254: Q8.3 3.44,34.65 v3.44,33.5 3.44,32.11 R26.1
CH_DI4_EX  (via drill 0.3)
  Top 0.254: CON3.4 3.81,32.23 3.57,31.98 v3.57,28.81
  Bottom 0.254: Q9.3 3.91,27.15 R27.1 v3.57,28.81
CH_DO2_EX
  Top 0.254: R20.2 10.72,27.92 7.5,27.92 7.12,28.3 7.12,29.19 6.58,29.73 CON3.6
CH_FLT_EX
  Top 0.254: CON3.5 6.22,30.98 6.87,30.33 10.34,30.33 R19.2
CH_NDI3
  Bottom 0.254: R23.2 7.25,30.46 CANIO_1.PB13
CH_NDI4
  Bottom 0.254: R24.2 6.49,26.65 CANIO_1.PB14
CH_NDO2
  Top 0.254: R18.1 14.91,29.82 Q6.3 12.5,29.78 11.44,30.84 9.41,30.84 CANIO_1.PB12
CH_NFLT
  Top 0.254: R17.1 13.39,34.01 Q5.3 12.79,34.27 CANIO_1.PB11
CH_PON
  Top 0.254: CANIO_1.PB10 8.77,37.06 R21.1 R22.2
CH_PON_EX
  Top 0.254: Q7.P$4 16.64,38.34 16.01,38.97 10.68,38.97 9.79,38.08 7.5,38.08 7.12,37.7 7.12,35.16 6.69,34.73 CON3.2
GND  (via drill 0.3)
  Top 0.254: X7.1 v11.95,13.41 | v25.41,13.41 X5.1 | C10.2 v49.54,33.25 49.54,34.27 49.29,34.52 R2.1 | CON3.1 v2.8,35.98 | R1.1 33.92,16.74 CANIO_1.GND1 | Q7.P$5 15.69,38.27 15.5,38.46 13.35,38.46 12.96,38.08 12.96,37.1 R21.2 13,36.99 v13.02,36.99 | R29.1 40.78,11.91 v41.16,11.53 | Q6.2 15.82,27.53 v15.89,27.47 | Q5.2 14.17,31.6 v14.23,31.53
  Top 0.406: X6.1 v18.81,13.41
  Bottom 0.254: ZD4.P$1 23.25,28.22 ZD4.P$11 v23.26,28.18 v23.25,28.17 | v27.06,28.17 v27.07,28.18 ZD3.P$11 27.06,28.22 ZD3.P$1 | ZD2.P$1 30.87,28.22 ZD2.P$11 v30.88,28.18 v30.87,28.17 | C7.2 C8.2 | C8.2 v25.16,33.5 | C9.2 C8.2 | C6.2 v8.01,13.57 | C5.2 v14.74,13.57 | C4.2 v21.47,13.57 | C3.2 10.23,7.54 9.28,8.49 v9.28,8.99 | IC3.2 v9.28,8.99 | 9.28,8.61 v9.28,8.99 | C2.2 16.9,7.47 16.9,7.6 16.01,8.49 v16.01,8.99 IC2.2 | IC1.2 v22.74,9.12 22.74,8.49 23.69,7.54 C1.2 | D1.A 40.68,11 v41.16,10.52 | R12.2 37.28,37.19 ZD6.P$1 | ZD6.P$11 ZD6.P$1 | ZD5.P$11 v36.96,41.77 v36.97,41.76 ZD5.P$1 36.97,41.25 R10.2 | v36.84,36.55 ZD6.P$1 | ZD1.P$11 v40.9,19.41 v40.91,19.41 ZD1.P$1 | IC5.12 v43.44,26.39 | v43.44,25.12 IC5.11 | v43.44,23.85 IC5.10 | v48.78,26.39 IC5.3 | IC4.4 v49.54,33.25 | C13.2 52.65,38.52 v52.72,38.58 | Q4.2 28.39,40.81 R16.1 28.59,40.74 | R3.1 47.19,18.83 v48.43,18.83 Q1.2 | Q9.2 3,26 v2.55,26.45 | Q8.2 2.43,35.6 v2.8,35.98 | IC5.5 v48.78,23.85 | IC5.4 v48.78,25.12
  other vias: 39.89,11.53 39.89,10.52 28.46,40.74
  pour Route2 (no thermals): 0.52,0.54 0.52,45.54 54.52,45.54 54.52,0.54
ILK1  (via drill 0.3)
  Top 0.254: CON3.8 5.05,6.62 7,4.68 v10.17,4.68
  Bottom 0.254: X9.P$3 23.81,4.12 SJ2.2 23.38,5.69 22.87,6.2 11.95,6.2 11.69,5.95 SJ1.2 11.57,4.68 v10.17,4.68
ILK1_CH  (via drill 0.3)
  Top 0.254: CON3.7 6.18,28.48 6.36,28.3 6.36,26.77 5.6,26.01 5.6,6.84 6.87,5.57 12.2,5.57 v12.96,4.8
  Bottom 0.254: X8.P$3 13.65,4.38 SJ1.1 v12.96,4.8
ILK2
  Bottom 0.254: SJ2.1 21.31,4 X9.P$2 19.78,0.87 12.67,0.87 X8.P$2
LEM_1  (via drill 0.3)
  Top 0.254: CANIO_1.PA1 26.81,26.65 23.25,30.2 ZD4.P$2
  Bottom 0.254: 21.35,31.68 C9.1 | C9.1 R8.2 | ZD4.P$2 21.46,31.56 C9.1
  other vias: 23.25,31.56
LEM_2  (via drill 0.3)
  Top 0.254: CANIO_1.PA2 29.43,29.19 ZD3.P$2
  Bottom 0.254: 25.16,31.68 C8.1 25.27,31.56 | ZD3.P$2 25.27,31.56 | 25.27,31.56 25.27,27.52 R7.2
  other vias: 27.06,31.56
LEM_3
  Bottom 0.254: 28.97,31.68 C7.1 | C7.1 R6.2 | C7.1 29.07,31.56 ZD2.P$2 30.87,31.69 33.88,31.69 CANIO_1.PA3
LK_1  (via drill 0.3)
  Top 0.254: CANIO_1.PA6 35.19,38.08 35.19,36.43 36.2,35.41 39.38,35.41 40.27,34.52 40.27,24.36 v42.05,22.58
  Bottom 0.254: v42.05,22.58 IC5.9
LK_2  (via drill 0.3)
  Top 0.254: CANIO_1.PA7 35.44,41.89 37.09,40.24 39,40.24 39.51,39.73 39.51,36.68 40.9,35.28 40.9,30.2 v47.13,23.98
  Bottom 0.254: v47.13,23.98 47.13,23.09 47.63,22.58 IC5.6
LK_EF
  Bottom 0.254: CANIO_1.PA0 35.95,24.11 R13.1 38.74,21.31 IC5.8
LK_RM
  Bottom 0.254: Q4.3 R14.1 8.65,41.76 CANIO_1.PB0
N$1
  Top 0.254: LED1.C R1.2
N$2
  Top 0.254: LED2.C 46.15,36.55 R2.2
N$3
  Bottom 0.254: R5.1 53.22,17.88 Q1.3 50.94,17.55 50.94,15.72 50.61,15.4 Q3.1
N$4  (via drill 0.3)
  Top 0.254: v24.52,10.91 X5.3
  Bottom 0.254: C4.1 IC1.5 23.69,11.09 23.88,10.91 v24.52,10.91
N$5
  Top 0.254: R29.2 39.16,15.34 LED3.C
N$6
  Bottom 0.254: Q3.3 51.31,13 X3.P$2
N$7  (via drill 0.3)
  Top 0.254: v13.35,12.16 X7.2
  Bottom 0.254: v13.35,12.16 13.35,15.22 14.23,16.11 23,16.11 23.5,16.61 23.5,23.22 R8.1
N$9  (via drill 0.3)
  Top 0.254: v17.66,10.91 X6.3
  Bottom 0.254: C5.1 IC2.5 16.96,11.09 17.14,10.91 v17.66,10.91
N$16
  Top 0.254: R20.1 13.88,27.54 Q6.1
N$25  (via drill 0.3)
  Top 0.254: CON1.1 41.59,42.09 41.92,41.76 41.92,39.98 41.29,39.35 v41.29,37.57
  Bottom 0.254: v41.29,37.57 R11.1
N$31  (via drill 0.3)
  Top 0.254: X6.2 v20.08,12.16
  Bottom 0.254: v20.08,12.16 20.08,14.33 21.35,15.6 23.38,15.6 25.28,17.5 25.28,25.25 R7.1
N$32  (via drill 0.3)
  Top 0.254: v10.93,10.91 X7.3
  Bottom 0.254: C6.1 IC3.5 10.23,11.09 10.41,10.91 v10.93,10.91
N$33  (via drill 0.3)
  Top 0.254: X5.2 v26.81,12.16
  Bottom 0.254: v26.81,12.16 26.81,23.22 R6.1
N$34
  Bottom 0.254: Q8.1 2.23,33.7 2.55,33.38 2.55,30.96 3.06,30.46 R23.1
N$35  (via drill 0.3)
  Top 0.254: v45.35,42.27 46.67,42.27 CON2.1
  Bottom 0.254: R9.1 44.08,42.01 44.33,42.27 v45.35,42.27
N$38
  Bottom 0.254: Q4.1 28.4,42.71 R15.1
N$39
  Bottom 0.254: R15.2 R16.2 30.49,35.28 32.65,33.12 41.67,33.12 45.09,29.7 51.95,29.7 53.1,28.55 53.1,24.31 X10.P$3
N$40
  Top 0.254: R28.1 18.17,35.41 Q7.P$3
N$41
  Bottom 0.254: IC5.13 47,27.66 47.63,27.03 49.83,27.03 X10.P$2
N$42
  Bottom 0.254: IC5.2 51.45,27.66 X10.P$1
N$43
  Top 0.254: R22.1 Q7.P$1
N$44
  Bottom 0.254: R24.1 Q9.1
N$45
  Top 0.254: Q5.1 12.22,31.69 R19.1
N$50
  Top 0.254: Q7.P$6 14.74,37.32 15,37.06 18.17,37.06 | R25.1 19.7,37.06 18.55,37.06 18.17,37.06 | 18.17,37.06 R28.2
TS1
  Bottom 0.254: C12.2 40.97,35.22 R11.2 R12.1 38.11,35.16 37.39,34.44 ZD6.P$2 34.09,34.44 CANIO_1.PA4
TS2
  Bottom 0.254: CANIO_1.PA5 36.38,39.26 ZD5.P$2 37.01,39.22 R10.1 42.3,39.22 C11.2 44.08,39.29 R9.2
VBAT  (via drill 0.3)
  Top 0.254: C10.1 v51.57,33.25 | R25.2 18.85,36.55 16.27,36.55 15.69,35.98 Q7.P$2 v15.69,35.16 | LED3.A 37.51,13.28 TB2.VIN
  Bottom 0.254: D1.C 40.7,5.9 v41.16,5.44 | IC5.7 v48.78,21.31 | IC5.1 v48.78,28.93 | IC4.2 52.08,32.74 v51.57,33.25 | Q3.2 53.53,15.4 R5.2 | R27.2 2.23,28.82 v2.23,28.81 | R26.2 v1.46,32.11
  other vias: 41.16,6.45 39.89,6.45 39.89,5.44 51.76,15.4
  pour Route15 (no thermals): 54.52,34.54 54.52,0.54 0.52,0.54 0.52,39.54 15.02,39.54 16.02,38.54 16.02,19.54 15.02,18.54 6.52,18.54 5.02,17.04 5.02,9.04 6.52,7.54 30.02,7.54 31.52,9.04 31.52,20.04 32.52,21.04 39.52,21.04 40.52,20.04 40.52,17.54 42.02,16.04 47.52,16.04 49.02,17.54 49.02,33.54 50.02,34.54
VCC_CONV  (via drill 0.3)
  Top 0.254: CANIO_1.PB15 29.22,24.11 33.03,20.3 34.94,20.3 35.82,19.41 35.82,18.27 37.22,16.87 v45.6,16.87
  Bottom 0.254: Q1.1 47.19,16.93 R3.2 v45.6,16.87
VREF_PTC_CH  (via drill 0.3)
  Top 0.254: v45.35,40.84 CON2.2 | CON1.2 v40.78,40.84
  Bottom 0.254: IC4.6 50.81,38.4 C13.1 50.75,38.65 v50.81,38.71 | C12.1 v42.68,36.68 | C11.1 42.3,40.84 v40.78,40.84
  pour Route15 (no thermals): 35.52,45.54 35.52,36.54 36.52,35.54 54.52,35.54 54.52,45.54

### Text on the board
Bottom: bottom | Bordnetz- & / Laderegler / Steuerung / V2.0
tTest: Bordnetz- & / Laderegler / Steuerung | TERA TU Graz, / April 2015 / Pöschl | 3V3 | LEM 1 | LEM 3 | LEM 2 | 5V